# Altium schematic sheet tank_adapter_power.SchDoc
size A4; SheetNumber: 2; SheetTotal: 2
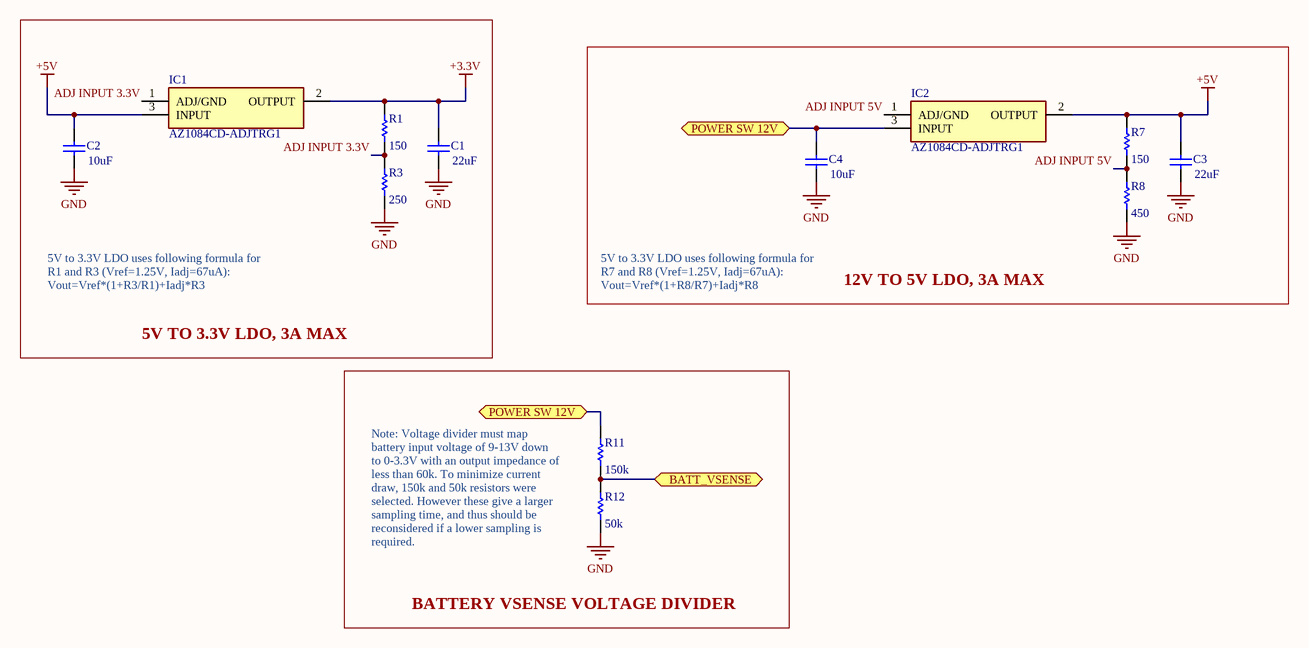
[diagram p0: tank_adapter_power.SchDoc]

## Parts
C1  value 22uF  [C0805]  (hidden comment: Cap)
C2  value 10uF  [C0805]  (hidden comment: Cap)
C3  value 22uF  [C0805]  (hidden comment: Cap)
C4  value 10uF  [C0805]  (hidden comment: Cap)
IC1  AZ1084CD-ADJTRG1  [AZ1084CDADJTRG1]
IC2  AZ1084CD-ADJTRG1  [AZ1084CDADJTRG1]
R1  value 150  [6-0805_M]  (hidden comment: Res1)
R3  value 250  [6-0805_M]  (hidden comment: Res1)
R7  value 150  [6-0805_M]  (hidden comment: Res1)
R8  value 450  [6-0805_M]  (hidden comment: Res1)
R11  value 150k  [6-0805_M]  (hidden comment: Res1)
R12  value 50k  [6-0805_M]  (hidden comment: Res1)

## Blocks framed on the sheet
5V TO 3.3V LDO, 3A MAX: C1 C2 IC1 R1 R3
12V TO 5V LDO, 3A MAX: C3 C4 IC2 R7 R8
BATTERY VSENSE VOLTAGE DIVIDER: R11 R12

## Ports
BATT_VSENSE (bidir), POWER SW 12V (bidir)

## Nets
+3.3V: C1.2 IC1.2(OUTPUT) R1.2
+5V: C2.2 C3.2 IC1.3(INPUT) IC2.2(OUTPUT) R7.2
GND: C1.1 C2.1 C3.1 C4.1 R3.1 R8.1 R12.1
ADJ INPUT 3.3V: IC1.1(ADJ/GND) R1.1 R3.2
ADJ INPUT 5V: IC2.1(ADJ/GND) R7.1 R8.2
BATT_VSENSE: R11.1 R12.2 ; port BATT_VSENSE
POWER SW 12V: C4.2 IC2.3(INPUT) R11.2 ; port POWER SW 12V

## Notes on the sheet
- 5V to 3.3V LDO uses following formula for R1 and R3 (Vref=1.25V, Iadj=67uA): Vout=Vref*(1+R3/R1)+Iadj*R3
- 5V to 3.3V LDO uses following formula for R7 and R8 (Vref=1.25V, Iadj=67uA): Vout=Vref*(1+R8/R7)+Iadj*R8
- Note: Voltage divider must map battery input voltage of 9-13V down to 0-3.3V with an output impedance of less than 60k. To minimize current draw, 150k and 50k resistors were selected. However these give a larger sampling time, and thus should be reconsidered if a lower sampling is required.

## Library data of the parts
C1-C4 = Cap: Capacitor; Published: 8-Jun-2000; LatestRevisionDate: 17-Jul-2002; LatestRevisionNote: Re-released for DXP Platform.; PackageReference: RAD-0.3; Publisher: Altium Limited; PackageDescription: Radial Cap, Thru-Hole; 2 Leads; 0.3 in Pin Spacing
IC1 IC2 = AZ1084CD-ADJTRG1: Integrated Circuit; Manufacturer_Name: Diodes Inc.; Datasheet Link: https://componentsearchengine.com//AZ1084CD-ADJTRG1.pdf; Height: 2.39mm; Mouser2 Part Number: 621-AZ1084CD-ADJTRG1; Mouser2 Price/Stock: https://www.mouser.com/Search/Refine.aspx?Keyword=621-AZ1084CD-ADJTRG1; Manufacturer_Part_Number: AZ1084CD-ADJTRG1
R1 R3 R7 R8 R11 R12 = Res1: Resistor; Published: 8-Jun-2000; LatestRevisionDate: 17-Jul-2002; LatestRevisionNote: Re-released for DXP Platform.; PackageReference: AXIAL-0.3; Publisher: Altium Limited; PackageDescription: Axial Device, Thru-Hole; 2 Leads; 0.3 in Pin Spacing